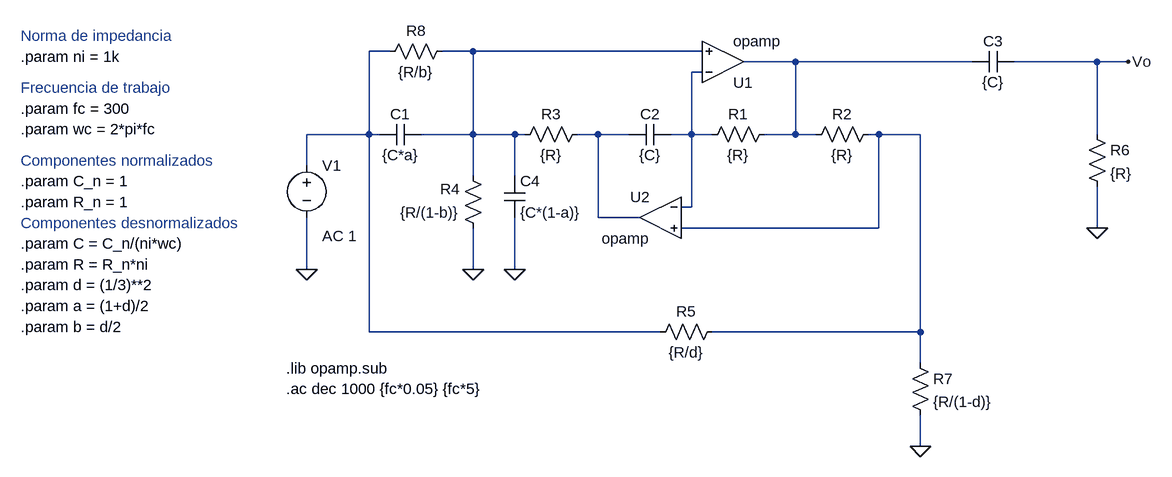
[diagram p0: schematic TS5_b.asc]
TS5_b.asc, the LTspice schematic file:
Version 4
SHEET 1 880 708
WIRE -320 80 -352 80
WIRE -192 80 -240 80
WIRE 160 80 -192 80
WIRE 304 96 224 96
WIRE 576 96 304 96
WIRE 768 96 640 96
WIRE 816 96 768 96
WIRE 160 112 144 112
WIRE -352 208 -352 80
WIRE -352 208 -448 208
WIRE -336 208 -352 208
WIRE -192 208 -192 80
WIRE -192 208 -272 208
WIRE -128 208 -192 208
WIRE -112 208 -128 208
WIRE 0 208 -32 208
WIRE 48 208 0 208
WIRE 144 208 144 112
WIRE 144 208 112 208
WIRE 176 208 144 208
WIRE 304 208 304 96
WIRE 304 208 256 208
WIRE 336 208 304 208
WIRE 432 208 416 208
WIRE 496 208 432 208
WIRE 768 208 768 96
WIRE -448 256 -448 208
WIRE -192 272 -192 208
WIRE -128 272 -128 208
WIRE 144 320 144 208
WIRE 144 320 128 320
WIRE 0 336 0 208
WIRE 64 336 0 336
WIRE 432 352 432 208
WIRE 432 352 128 352
WIRE 768 352 768 288
WIRE -448 416 -448 336
WIRE -192 416 -192 352
WIRE -128 416 -128 336
WIRE -352 512 -352 208
WIRE 96 512 -352 512
WIRE 496 512 496 208
WIRE 496 512 176 512
WIRE 496 560 496 512
WIRE 496 688 496 640
FLAG -192 416 0
FLAG -448 416 0
FLAG 768 352 0
FLAG 496 688 0
FLAG -128 416 0
FLAG 816 96 Vo
SYMBOL OpAmps\\opamp 192 160 M180
SYMATTR InstName U1
SYMBOL OpAmps\\opamp 96 272 M0
SYMATTR InstName U2
SYMBOL res 272 192 R90
WINDOW 0 0 56 VBottom 2
WINDOW 3 32 56 VTop 2
SYMATTR InstName R1
SYMATTR Value {R}
SYMBOL res 432 192 R90
WINDOW 0 0 56 VBottom 2
WINDOW 3 32 56 VTop 2
SYMATTR InstName R2
SYMATTR Value {R}
SYMBOL res -16 192 R90
WINDOW 0 0 56 VBottom 2
WINDOW 3 32 56 VTop 2
SYMATTR InstName R3
SYMATTR Value {R}
SYMBOL res -176 368 R180
WINDOW 0 36 76 Left 2
WINDOW 3 36 40 Left 2
SYMATTR InstName R4
SYMATTR Value {R/(1-b)}
SYMBOL cap -272 192 R90
WINDOW 0 0 32 VBottom 2
WINDOW 3 32 32 VTop 2
SYMATTR InstName C1
SYMATTR Value {C*a}
SYMBOL cap 112 192 R90
WINDOW 0 0 32 VBottom 2
WINDOW 3 32 32 VTop 2
SYMATTR InstName C2
SYMATTR Value {C}
SYMBOL res 192 496 R90
WINDOW 0 0 56 VBottom 2
WINDOW 3 32 56 VTop 2
SYMATTR InstName R5
SYMATTR Value {R/d}
SYMBOL voltage -448 240 R0
WINDOW 123 24 124 Left 2
WINDOW 39 0 0 Left 0
SYMATTR Value2 AC 1
SYMATTR InstName V1
SYMATTR Value ""
SYMBOL cap 640 80 R90
WINDOW 0 0 32 VBottom 2
WINDOW 3 32 32 VTop 2
SYMATTR InstName C3
SYMATTR Value {C}
SYMBOL res 752 192 R0
SYMATTR InstName R6
SYMATTR Value {R}
SYMBOL res 480 544 R0
SYMATTR InstName R7
SYMATTR Value {R/(1-d)}
SYMBOL res -224 64 R90
WINDOW 0 0 56 VBottom 2
WINDOW 3 32 56 VTop 2
SYMATTR InstName R8
SYMATTR Value {R/b}
SYMBOL cap -144 272 R0
SYMATTR InstName C4
SYMATTR Value {C*(1-a)}
TEXT -480 568 Left 2 !.lib opamp.sub
TEXT -480 600 Left 2 !.ac dec 1000 {fc*0.05} {fc*5}
TEXT -888 168 Left 2 !.param fc = 300
TEXT -888 200 Left 2 !.param wc = 2*pi*fc
TEXT -888 136 Left 2 ;Frecuencia de trabajo
TEXT -888 248 Left 2 ;Componentes normalizados
TEXT -888 280 Left 2 !.param C_n = 1
TEXT -888 312 Left 2 !.param R_n = 1
TEXT -888 344 Left 2 ;Componentes desnormalizados
TEXT -888 56 Left 2 ;Norma de impedancia
TEXT -888 88 Left 2 !.param ni = 1k
TEXT -888 376 Left 2 !.param C = C_n/(ni*wc)
TEXT -888 408 Left 2 !.param R = R_n*ni
TEXT -888 440 Left 2 !.param d = (1/3)**2
TEXT -888 472 Left 2 !.param a = (1+d)/2
TEXT -888 504 Left 2 !.param b = d/2

The netlist it stands for:
* TS5_b.asc
XU1 N004 N002 N003 opamp Aol=100K GBW=10Meg  ; pins invin noninvin out
XU2 N004 N006 N005 opamp Aol=100K GBW=10Meg  ; pins invin noninvin out
R1 N003 N004 {R}
R2 N006 N003 {R}
R3 N005 N002 {R}
R4 0 N002 {R/(1-b)}
C1 N002 N001 {C*a}
C2 N004 N005 {C}
R5 N006 N001 {R/d}
V1 N001 0 AC 1
C3 Vo N003 {C}
R6 Vo 0 {R}
R7 N006 0 {R/(1-d)}
R8 N002 N001 {R/b}
C4 N002 0 {C*(1-a)}
.lib opamp.sub
.ac dec 1000 {fc*0.05} {fc*5}
.param fc = 300
.param wc = 2*pi*fc
* Frecuencia de trabajo
* Componentes normalizados
.param C_n = 1
.param R_n = 1
* Componentes desnormalizados
* Norma de impedancia
.param ni = 1k
.param C = C_n/(ni*wc)
.param R = R_n*ni
.param d = (1/3)**2
.param a = (1+d)/2
.param b = d/2
.backanno
.end